# EAGLE design Node (EAGLE 9.6.2)
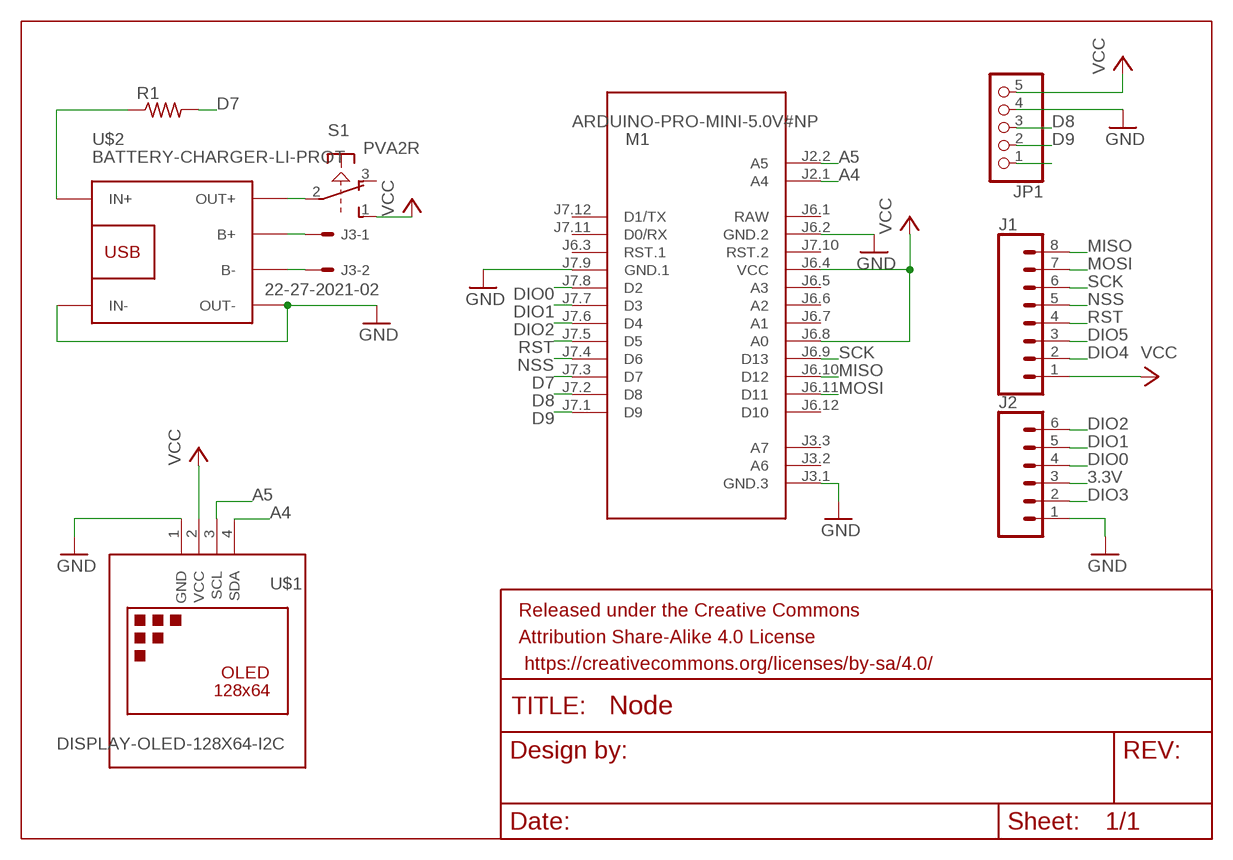
[diagram p0: schematic, sheet 1]

## Parts
FRAME1  FRAME-LEDGER  [CREATIVE_COMMONS]
J1  CONN_08"  [1X08]
J2  CONN_06SILK_FEMALE_PTH  [1X06]
J3  22-27-2021-02  [6410-02]
JP1  PINHD-1X5/90  [1X05/90]
M1  ARDUINO-PRO-MINI-5.0V#NP  [ARDUINO-PRO-MINI#NP]
R1  R-US_R1206  [R1206]
S1  PVA2R  [PVA2R]
U$1  DISPLAY-OLED-128X64-I2C  [DISPLAY-OLED-128X64-I2C]
U$2  BATTERY-CHARGER-LI-PROT  [BATTERY-CHARGER-LI-PROT]

## Nets
3.3V: J2.3
A4: M1.J2.1(A4) U$1.4(SDA)
A5: M1.J2.2(A5) U$1.3(SCL)
D7: M1.J7.3(D7) R1.2
D8: JP1.3 M1.J7.2(D8)
D9: JP1.2 M1.J7.1(D9)
DIO0: J2.4 M1.J7.8(D2)
DIO1: J2.5 M1.J7.7(D3)
DIO2: J2.6 M1.J7.6(D4)
DIO3: J2.2
DIO4: J1.2
DIO5: J1.3
GND: J2.1 JP1.4 M1.J3.1(GND.3) M1.J6.2(GND.2) M1.J7.9(GND.1) U$1.1(GND) U$2.IN- U$2.OUT-
MISO: J1.8 M1.J6.10(D12)
MOSI: J1.7 M1.J6.11(D11)
N$1: R1.1 U$2.IN+
N$15: J3.1 U$2.B+
N$16: J3.2 U$2.B-
N$19: S1.2(1:P) U$2.OUT+
N$23: JP1.1
NSS: J1.5 M1.J7.4(D6)
RST: J1.4 M1.J7.5(D5)
SCK: J1.6 M1.J6.9(D13)
VCC: J1.1 JP1.5 M1.J6.4(VCC) M1.J6.8(A0) S1.1(1:S) U$1.2(VCC)
Unconnected: M1.J3.2(A6) M1.J3.3(A7) M1.J6.3(RST.1) M1.J6.5(A3) M1.J6.6(A2) M1.J6.7(A1) M1.J6.12(D10) M1.J7.10(RST.2) M1.J7.11(D0/RX) M1.J7.12(D1/TX) S1.3(1:O) S1.4(2:S) S1.5(2:P) S1.6(2:O)

## Power pins joined to a net without a drawn wire
RAW: M1.J6.1(RAW)

## Library data of the parts
FRAME1 = SparkFun-Aesthetics:FRAME-LEDGER: Schematic Frame - Ledger Standard 11x14 US Ledger frame
J1 = SparkFun-Connectors:CONN_08: Multi connection point. Often used as Generic Header-pin footprint for 0.1 inch spaced/style header connections On any of the 0.1 inch spaced packages, you can populate with these: Break Away Headers - Straight <https://www.sparkfun.com/products/116> (PRT-00116) Break Away Male Headers - Right Angle <https://www.sparkfun.com/products/553> (PRT-00553) Female Headers <https://www.sparkfun.com/products/115> (PRT-00115) Break Away Headers - Machine Pin <https://www.sparkfun.com/products/117> (PRT-00117) Break Away Female Headers - Swiss Machine Pin <https://www.sparkfun.com/products/743> (PRT-00743) Arduino Stackable Header - 8 Pin <https://www.sparkfun.com/products/9279> (PRT-09279) For SCREWTERMINALS and SPRING TERMINALS visit here: Screw Terimnals on SparkFun.com <https://www.sparkfun.com/search/results?term=Screw+Terminals> (5mm/3.5mm/2.54mm spacing) This device is also useful as a general connection point to wire up your design to another part of your project. Our various solder wires solder well into these plated through hole pads. Hook-Up Wire - Assortment (Stranded, 22 AWG) <https://www.sparkfun.com/products/11375> (PRT-11375) Hook-Up Wire - Assortment (Solid Core, 22 AWG) <https://www.sparkfun.com/products/11367> (PRT-11367) View the entire wire category on our website here <https://www.sparkfun.com/categories/141> Special notes: Molex polarized connector foot print use with SKU : PRT-08231 with associated crimp pins and housings. 1MM SMD Version SKU: PRT-10208 NOTES ON THE VARIANTS LOCK and LOCK_LONGPADS... This footprint was designed to help hold the alignment of a through-hole component (i.e. 6-pin header) while soldering it into place. You may notice that each hole has been shifted either up or down by 0.005 of an inch from it's more standard position (which is a perfectly straight line). This slight alteration caused the pins (the squares in the middle) to touch the edges of the holes. Because they are alternating, it causes a "brace" to hold the component in place. 0.005 has proven to be the perfect amount of "off-center" position when using our standard breakaway headers. Although looks a little odd when you look at the bare footprint, once you have a header in there, the alteration is very hard to notice. Also,if you push a header all the way into place, it is covered up entirely on the bottom side.; PROD_ID: CONN-08438
J2 = SparkFun-Connectors:CONN_06: Multi connection point. Often used as Generic Header-pin footprint for 0.1 inch spaced/style header connections On any of the 0.1 inch spaced packages, you can populate with these: Break Away Headers - Straight <https://www.sparkfun.com/products/116> (PRT-00116) Break Away Male Headers - Right Angle <https://www.sparkfun.com/products/553> (PRT-00553) Female Headers <https://www.sparkfun.com/products/115> (PRT-00115) Break Away Headers - Machine Pin <https://www.sparkfun.com/products/117> (PRT-00117) Break Away Female Headers - Swiss Machine Pin <https://www.sparkfun.com/products/743> (PRT-00743) Arduino Stackable Header - 6 Pin <https://www.sparkfun.com/products/9280> (PRT-09280) For SCREWTERMINALS and SPRING TERMINALS visit here: Screw Terimnals on SparkFun.com <https://www.sparkfun.com/search/results?term=Screw+Terminals> (5mm/3.5mm/2.54mm spacing) This device is also useful as a general connection point to wire up your design to another part of your project. Our various solder wires solder well into these plated through hole pads. Hook-Up Wire - Assortment (Stranded, 22 AWG) <https://www.sparkfun.com/products/11375> (PRT-11375) Hook-Up Wire - Assortment (Solid Core, 22 AWG) <https://www.sparkfun.com/products/11367> (PRT-11367) View the entire wire category on our website here <https://www.sparkfun.com/categories/141>; PROD_ID: CONN-08437
J3 = con-molex:22-?-02: CONNECTOR wire to board 2.54 mm (.1 inch) pitch header; MF: MOLEX; OC_FARNELL: unknown; OC_NEWARK: unknown
JP1 = pinhead:PINHD-1X5: PIN HEADER
M1 = diy-modules:ARDUINO-PRO-MINI-*#NP: Arduino Pro Mini (and compatible devices) without programming pads More details available here: https://www.arduino.cc/en/Main/ArduinoBoardProMini Click here to find device on ebay.com <http://www.ebay.com/sch/arduino+pro+mini>
R1 = rcl:R-US_: RESISTOR, American symbol; SPICEPREFIX: R
S1 = switch-misc:PVA2R: ITT SWITCH
U$1 = diy-modules:DISPLAY-OLED-128X64-I2C: 128x64 Dot Matrix OLED Module based on SSD1306 chip Variant with I2C interface More details available here: http://www.instructables.com/id/Monochrome-096-i2c-OLED-display-with-arduino-SSD13/ SSD1306 datasheet: https://cdn-shop.adafruit.com/datasheets/SSD1306.pdf Click here to find device on ebay.com <http://www.ebay.com/sch/oled+display+128x64+iic> Note: There are two variants: I2C and SPI. Search for the proper version.
U$2 = diy-modules:BATTERY-CHARGER-LI-PROT: Lithium Battery 5V Charger with protection circuit More details available here: http://www.instructables.com/id/DIY-Lithium-ion-Battery-Charger/step4/TP4056-based-lithium-ion-battery-charger-module/ Click here to find device on ebay.com <http://www.ebay.com/sch/tp4056+charger+usb+protection>

## Board
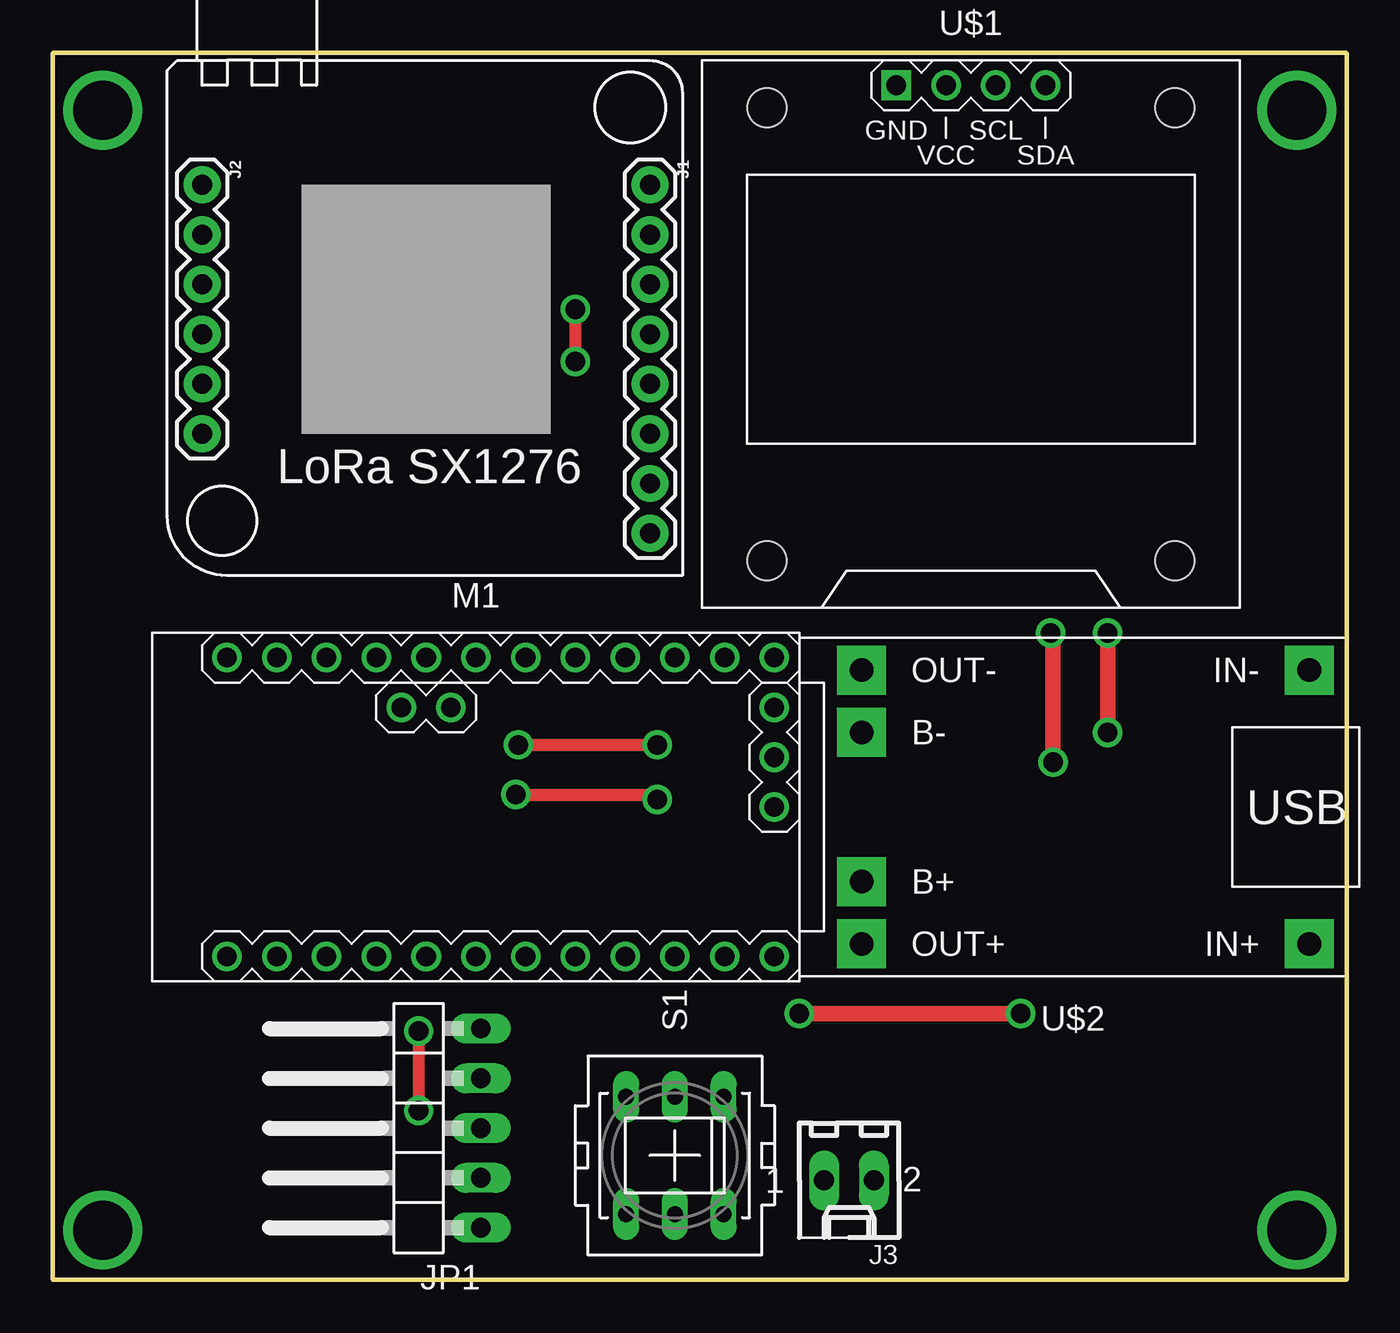
[diagram p1: board, top side]
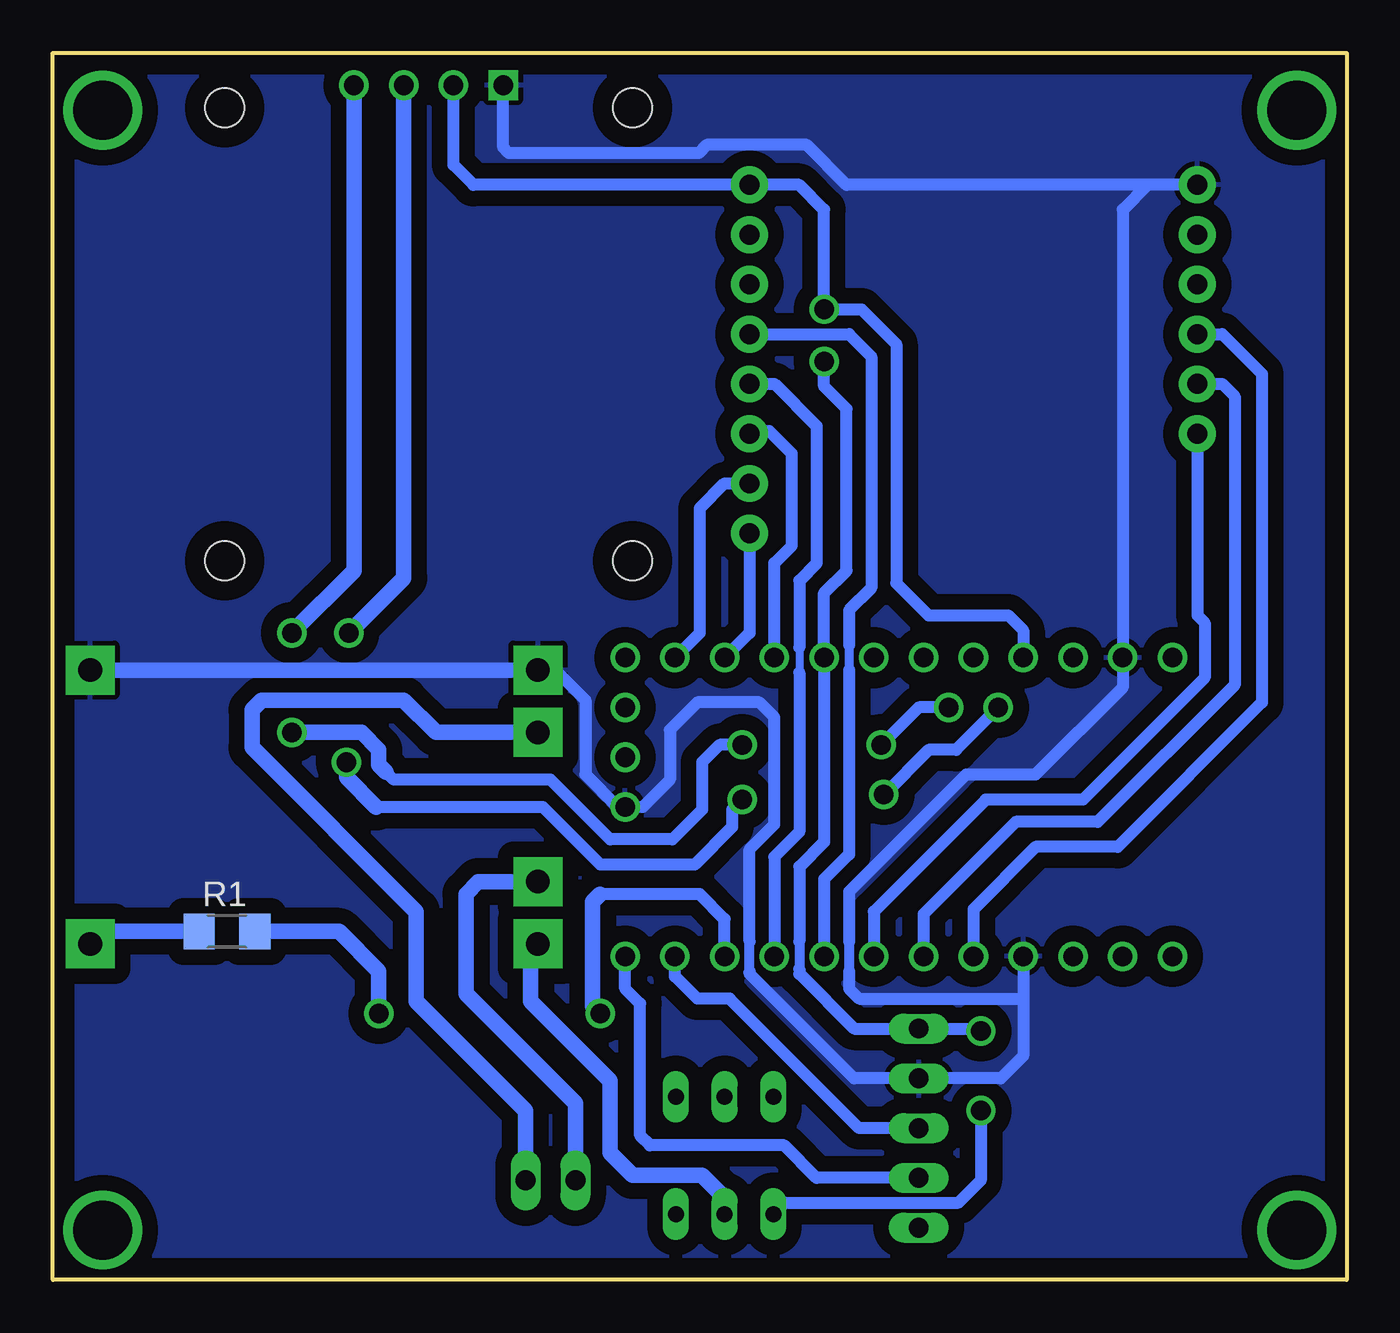
[diagram p2: board, bottom side, seen from below]

Size 66.04 x 62.61 mm. Coordinates in mm from the lower left corner, seen from the top.
Outline: 0,0 66.04,0 66.04,62.61 0,62.61 0,0
Copper layers (1*16): Top 0.035mm / dielectric 1.5mm / Bottom 0.035mm
Design rules "default": minimum track width 6mil, minimum drill 0.35mm, track to track 6mil, track to pad 6mil, pad to pad 6mil, via to via 6mil, smd to smd 6mil, copper to edge 40mil, drill to drill 6mil, minimum pad ring 10mil, minimum via ring 8mil, stop-mask expansion 4mil, vias tented up to drill 0mil, thermal gap 10mil

### Footprints (pad centres in the part's own frame; a part is rotated, then mirrored left to right if it is on the bottom)
1X08 = drill 1.016 pad 1.88: 1 0,0; 2 2.54,0; 3 5.08,0; 4 7.62,0; 5 10.16,0; 6 12.7,0; 7 15.24,0; 8 17.78,0
1X06 = drill 1.016 pad 1.88: 1 0,0; 2 2.54,0; 3 5.08,0; 4 7.62,0; 5 10.16,0; 6 12.7,0
6410-02 = drill 1.016 long: 1 1.27,0; 2 -1.27,0
1X05/90 = drill 1.016 long: 1 -5.08,-3.81; 2 -2.54,-3.81; 3 0,-3.81; 4 2.54,-3.81; 5 5.08,-3.81
ARDUINO-PRO-MINI#NP = drill 1: J2.1 -1.27,5.08; J2.2 -3.81,5.08; J3.1 15.24,0; J3.2 15.24,2.54; J3.3 15.24,5.08; J6.1 -12.7,7.62; J6.2 -10.16,7.62; J6.3 -7.62,7.62; J6.4 -5.08,7.62; J6.5 -2.54,7.62; J6.6 0,7.62; J6.7 2.54,7.62; J6.8 5.08,7.62; J6.9 7.62,7.62; J6.10 10.16,7.62; J6.11 12.7,7.62; J6.12 15.24,7.62; J7.1 15.24,-7.62; J7.2 12.7,-7.62; J7.3 10.16,-7.62; J7.4 7.62,-7.62; J7.5 5.08,-7.62; J7.6 2.54,-7.62; J7.7 0,-7.62; J7.8 -2.54,-7.62; J7.9 -5.08,-7.62; J7.10 -7.62,-7.62; J7.11 -10.16,-7.62; J7.12 -12.7,-7.62
R1206 = smd 1.6 x 1.803: 1 -1.422,0; 2 1.422,0
PVA2R = drill 0.813 long: 1 -2.997,2.489; 2 -2.997,0; 3 -2.997,-2.489; 4 2.997,2.489; 5 2.997,0; 6 2.997,-2.489
DISPLAY-OLED-128X64-I2C = drill 1 square: 1 -3.81,12.7 | drill 1: 2 -1.27,12.7; 3 1.27,12.7; 4 3.81,12.7 | hole 2: -10.414,11.557; 10.414,11.557; 10.414,-11.557; -10.414,-11.557
BATTERY-CHARGER-LI-PROT = drill 1.2 pad 2.5 square: B+ 10.795,3.81; B- 10.795,-3.81; IN+ -12.065,6.985; IN- -12.065,-6.985; OUT+ 10.795,6.985; OUT- 10.795,-6.985

### Placement (x,y rotation side)
FRAME1  15.24,-8.89 0 top  (outside the outline)
J1  30.48,55.88 270 top
J2  7.62,55.88 270 top
J3  40.64,5.08 180 top
JP1  18.03,7.75 90 top
M1  21.59,24.13 0 top
R1  57.15,17.78 0 bottom
S1  31.75,6.35 90 top
U$1  46.86,48.26 0 top
U$2  52.07,24.13 180 top

### Tracks (layer width: path | path; a pad name or v marks a point on that pad's centre or on a via)
A4  (via drill 1)
  Top 0.6: v23.75,27.3 v30.86,27.3
  Top 0.8: v53.85,27.94 v53.85,33.02
  Bottom 0.6: M1.J2.1 21.84,29.21 v23.75,27.3 | v30.86,27.3 32,27.3 32.89,26.42 32.89,24 34.42,22.48 37.59,22.48 40.64,25.53 48.64,25.53 49.02,25.91 49.15,26.04
  Bottom 0.8: 49.02,25.91 49.4,26.29 49.4,27.05 50.29,27.94 v53.85,27.94 | U$1.4 50.67,36.2 v53.85,33.02
A5  (via drill 1)
  Top 0.6: v23.62,24.77 30.61,24.77 v30.86,24.51
  Top 0.8: v51.05,26.42 51.05,32.89 v50.93,33.02
  Bottom 0.6: M1.J2.2 19.94,27.05 21.34,27.05 v23.62,24.77 | v30.86,24.51 31.37,24 31.37,23.11 33.27,21.21 38.1,21.21 41.02,24.13 49.53,24.13
  Bottom 0.8: 49.53,24.13 51.05,25.65 v51.05,26.42 | v50.93,33.02 48.13,35.81 U$1.3
D7  (via drill 1)
  Top 0.8: v38.1,13.59 v49.4,13.59
  Bottom 0.6: M1.J7.3 31.75,18.41 33.02,19.68 38.1,19.68 38.23,19.68
  Bottom 0.8: 38.1,19.68 38.48,19.3 38.48,13.97 v38.1,13.59 | v49.4,13.59 49.4,15.75 51.44,17.78 R1.2
D8
  Bottom 0.6: M1.J7.2 34.29,15.49 33.15,14.35 31.5,14.35 24.89,7.75 JP1.3
D9
  Bottom 0.6: M1.J7.1 36.83,14.86 36.07,14.1 36.07,7.37 35.56,6.86 28.7,6.86 27.05,5.21 JP1.2
DIO0
  Bottom 0.6: J2.4 6.35,48.26 4.32,46.23 4.32,29.46 11.68,22.1 15.88,22.1 19.05,18.92 M1.J7.8
DIO1
  Bottom 0.6: J2.5 6.35,45.72 5.71,45.09 5.71,30.35 12.7,23.37 16.89,23.37 21.59,18.67 M1.J7.7
DIO2
  Bottom 0.6: J2.6 7.62,33.91 7.24,33.53 7.24,30.73 13.46,24.51 18.41,24.51 24.13,18.8 M1.J7.6
GND
  Bottom 0.5: 25.4,17.27 25.4,15.75 | 30.48,15.75 30.48,17.27
  Bottom 0.6: J2.1 10.16,55.88 | 10.16,55.88 11.43,54.61 M1.J6.2 11.43,30.23 15.88,25.78 19.43,25.78 25.4,19.81 25.4,17.27 | M1.J7.9 16.51,14.35 | 25.4,15.75 25.4,14.86 24.89,14.35 16.51,14.35 | U$1.1 43.05,57.78 42.77,57.5 33.08,57.5 32.67,57.91 27.56,57.91 25.53,55.88 10.16,55.88 | JP1.4 21.97,10.16 | 30.48,15.75 30.48,15.62 25.15,10.29 JP1.4 | 30.48,17.27 30.48,21.97 29.21,23.24 29.21,28.7 29.97,29.46 33.15,29.46 34.54,28.07 34.54,25.53 35.94,24.13 M1.J3.1 37.21,24.13 38.86,25.78 38.86,29.59 40.26,30.99 41.15,30.99 U$2.OUT- | 16.51,14.35 16.51,11.43 17.65,10.29 JP1.4
  Bottom 0.8: U$2.OUT- U$2.IN-
  pour Bottom (isolate 0.8): 0,62.61 0,0 66.04,0 66.04,62.61
MISO
  Bottom 0.6: M1.J6.10 30.48,33.02 J1.8
MOSI
  Bottom 0.6: M1.J6.11 33.02,33.02 33.02,39.37 31.75,40.64 J1.7
N$1
  Bottom 0.8: R1.1 63.5,17.78 U$2.IN+
N$2  (via drill 3)
  other vias: 2.54,59.69
N$3  (via drill 3)
  other vias: 63.5,59.69
N$4  (via drill 3)
  other vias: 63.5,2.54
N$5  (via drill 3)
  other vias: 2.54,2.54
N$6
  Bottom 0.2: 0,0 66.04,0 66.04,62.61 0,62.61 0,0
N$15
  Bottom 0.8: U$2.B+ 44.32,20.32 44.96,19.68 44.96,14.61 39.37,9.02 J3.1
N$16
  Bottom 0.8: J3.2 41.91,8.64 47.5,14.22 47.5,18.8 55.88,27.18 55.88,29.08 55.37,29.59 48.13,29.59 46.48,27.94 U$2.B- 41.53,27.69
N$19
  Bottom 0.8: U$2.OUT+ 41.66,16.76 41.66,14.22 37.59,10.16 37.59,6.48 36.45,5.33 32.89,5.33 31.75,4.19 S1.2
NSS
  Bottom 0.4: 27.94,32.26 27.94,30.99
  Bottom 0.6: J1.5 29.21,45.72 27.05,43.56 27.05,36.58 27.94,35.69 27.94,32.26 | 27.94,30.99 27.94,22.86 29.21,21.59 M1.J7.4
RST
  Bottom 0.45: 25.4,32.38 25.4,31.11
  Bottom 0.6: 25.4,32.38 25.4,34.16 24.26,35.31 24.26,47.12 25.4,48.26 J1.4 | M1.J7.5 26.67,20.45 25.4,21.72 25.4,31.11
SCK
  Bottom 0.6: J1.6 30.35,43.31 29.46,43.31 28.32,42.16 28.32,37.47 29.21,36.58 M1.J6.9
VCC  (via drill 1)
  Top 0.6: v26.67,46.86 v26.67,49.53 | v18.67,12.7 18.73,12.64 18.67,12.57 v18.67,8.64
  Bottom 0.5: 27.94,17.27 27.94,15.88
  Bottom 0.6: v26.67,46.86 26.67,45.59 25.53,44.45 25.53,36.2 26.67,35.05 M1.J6.8 26.67,22.35 27.94,21.08 27.94,17.27 | M1.J6.4 16.51,33.15 17.27,33.91 21.34,33.91 22.99,35.56 22.99,47.75 24.77,49.53 v26.67,49.53 26.67,54.61 27.94,55.88 J1.1 44.58,55.88 45.59,56.9 U$1.2 | 27.94,15.88 27.94,15.62 25.15,12.83 JP1.5 18.8,12.83 v18.67,12.7 | v18.67,8.64 18.67,5.08 19.81,3.94 28.68,3.94 S1.1

### Text on the board
tPlace: LoRa SX1276